# Altium schematic sheet Schema_PicoAdapterGB_AGB.schdoc
size 254 x 136 mm
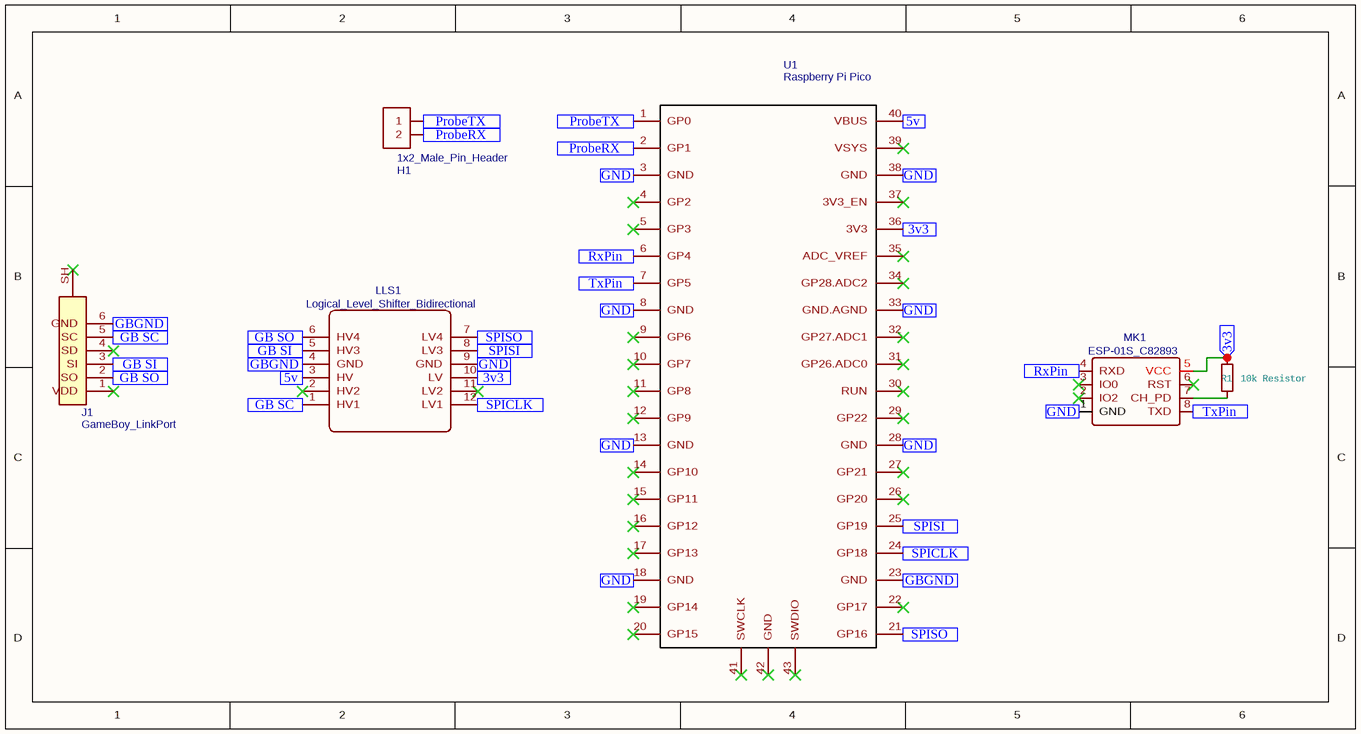
[diagram p0: Schema_PicoAdapterGB_AGB.schdoc]

## Parts
H1  1x2_Male_Pin_Header  [1X2/2.54_MALE_PIN_HEADER]
J1  GameBoy_LinkPort  [GAMEBOY_LINKPORT_MGB_HORIZONTAL]
LLS1  Logical_Level_Shifter_Bidirectional  [LOGIC_LEVEL BIDIRECTIONAL]
MK1  ESP-01S_C82893  [WIRELM-TH_ESP-01S]
R1  10k Resistor  [R_AXIAL_DIN0207_L6.3MM_D2.5MM_P10.16MM_HORIZONTAL]
U1  Raspberry Pi Pico  [FT_RASPBERRY-PI-PICO_TH]

## Ports
3v3 (in), 5v (in), GB SC (in), GB SI (in), GB SO (in), GBGND (in), GND (in), ProbeRX (in), ProbeTX (in), RxPin (in), SPICLK (in), SPISI (in), SPISO (in), TxPin (in)

## Nets
3v3: LLS1.10(LV) MK1.5(VCC) R1.1 U1.36(3V3) ; port 3v3
5v: LLS1.3(HV) U1.40(VBUS) ; port 5v
GB SC: J1.5(SC) LLS1.1(HV1) ; port GB SC
GB SI: J1.3(SI) LLS1.5(HV3) ; port GB SI
GB SO: J1.2(SO) LLS1.6(HV4) ; port GB SO
GBGND: J1.6(GND) LLS1.4(GND) U1.23(GND) ; port GBGND
GND: LLS1.9(GND) MK1.1(GND) U1.3(GND) U1.8(GND) U1.13(GND) U1.18(GND) U1.28(GND) U1.33(GND.AGND) U1.38(GND) ; port GND
ProbeRX: H1.2 U1.2(GP1) ; port ProbeRX
ProbeTX: H1.1 U1.1(GP0) ; port ProbeTX
RxPin: MK1.4(RXD) U1.6(GP4) ; port RxPin
SPICLK: LLS1.12(LV1) U1.24(GP18) ; port SPICLK
SPISI: LLS1.8(LV3) U1.25(GP19) ; port SPISI
SPISO: LLS1.7(LV4) U1.21(GP16) ; port SPISO
TxPin: MK1.8(TXD) U1.7(GP5) ; port TxPin
NetMK1_7: MK1.7(CH_PD) R1.2

Not connected (* = marked no-connect by the designer): J1 1(VDD)* 4(SD)* SH*; LLS1 2(HV2)* 11(LV2)*; MK1 2(IO2)* 3(IO0)* 6(RST)*; U1 4(GP2)* 5(GP3)* 9(GP6)* 10(GP7)* 11(GP8)* 12(GP9)* 14(GP10)* 15(GP11)* 16(GP12)* 17(GP13)* 19(GP14)* 20(GP15)* 22(GP17)* 26(GP20)* 27(GP21)* 29(GP22)* 30(RUN)* 31(GP26.ADC0)* 32(GP27.ADC1)* 34(GP28.ADC2)* 35(ADC_VREF)* 37(3V3_EN)* 39(VSYS)* 41(SWCLK)* 42(GND)* 43(SWDIO)*

## Library data of the parts
H1 = 1x2_Male_Pin_Header: BOM_Manufacturer Part: 210S-1*8P L=11.6MMGold-plated black; Contributor: stevenktb; spicePre: H; spiceSymbolName: 1x2_Male_Pin_Header
J1 = GameBoy_LinkPort: Contributor: zenaro147; spicePre: J; spiceSymbolName: GameBoy_LinkPort
LLS1 = Logical_Level_Shifter_Bidirectional: sourceId: ldJDwO6oi; Contributor: rdenning; timeStamp: 1462366452; spicePre: L; spiceSymbolName: Logical_Level_Shifter_Bidirectional
MK1 = ESP-01S_C82893: BOM_Manufacturer: Ai-Thinker; BOM_Supplier Part: C82893; BOM_Supplier: LCSC; BOM_Manufacturer Part: ESP-01S; spicePre: M; spiceSymbolName: ESP-01S_C82893
U1 = Raspberry Pi Pico: BOM_Manufacturer: Raspberry Pi Foundation; Contributor: Stingray sting; BOM_Supplier Part: Pico; BOM_Supplier: Digi-Key; spicePre: U; spiceSymbolName: Raspberry Pi Pico